# EAGLE design UtilityStrip1 (EAGLE 7.7.0)
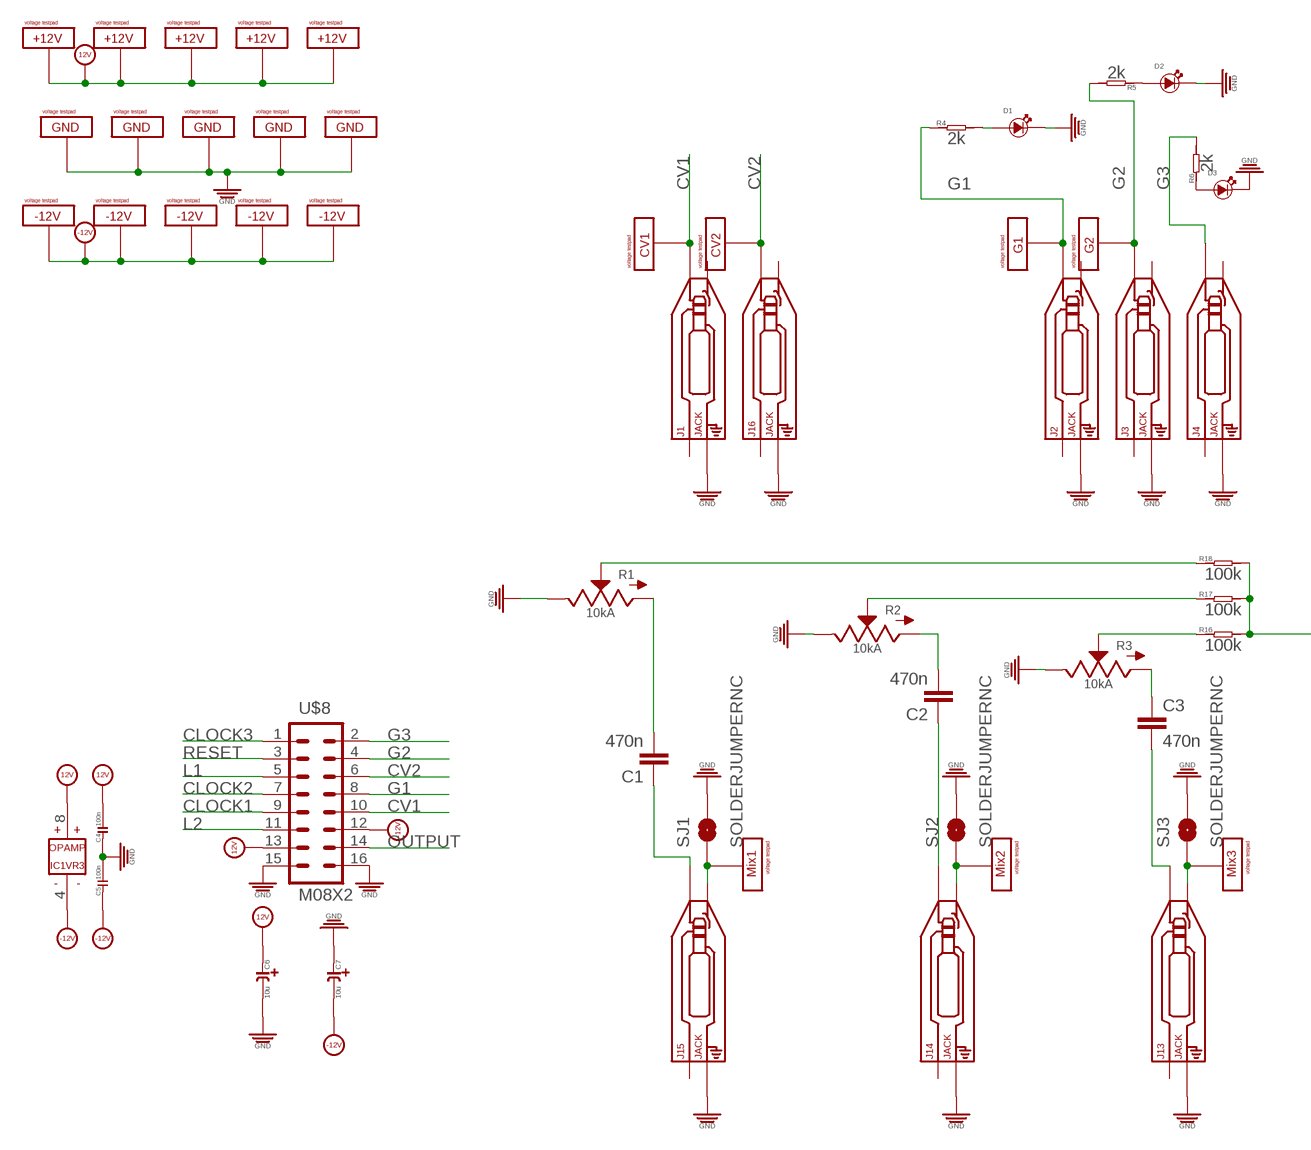
[diagram p0: schematic, sheet 1, part 1 of 2]
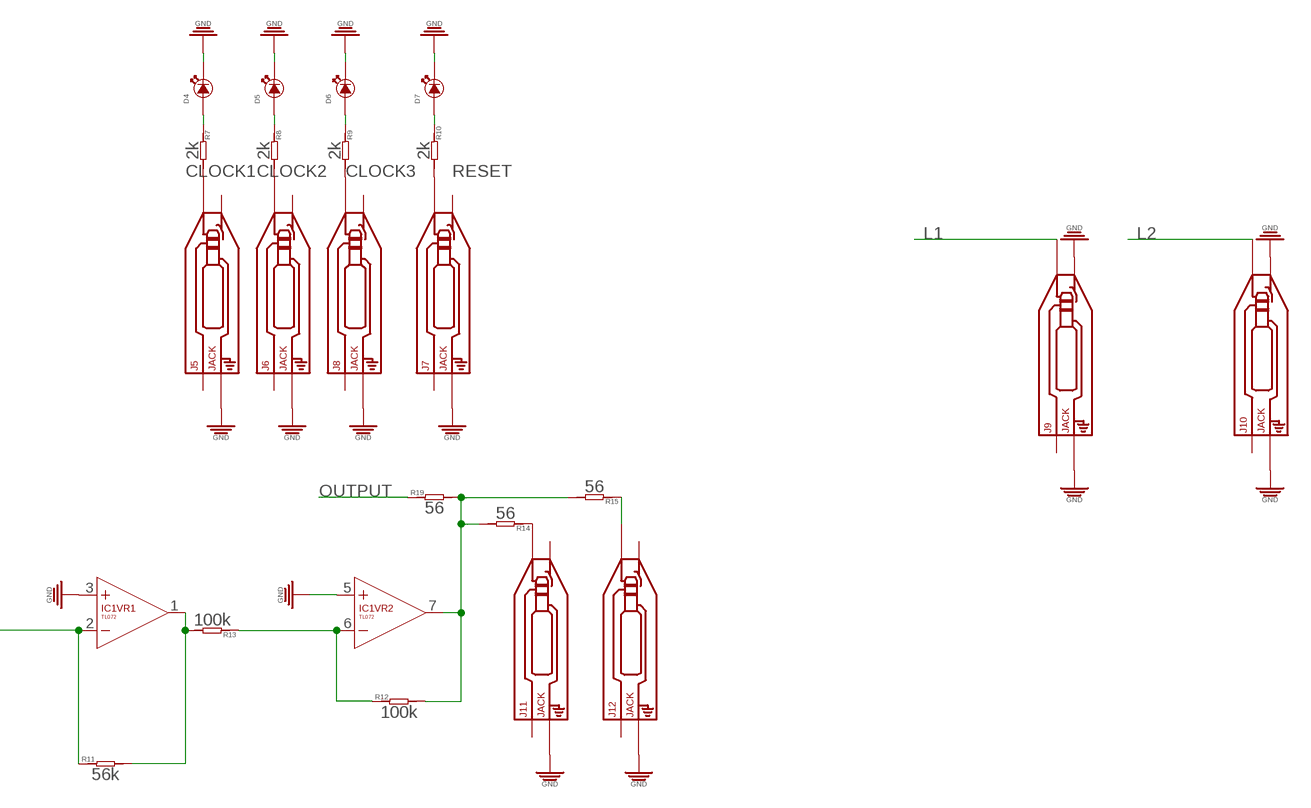
[diagram p1: schematic, sheet 1, part 2 of 2]

## Parts
C1  470n  C5/4.5  [C5B4.5]
C2  470n  C5/4.5  [C5B4.5]
C3  470n  C5/4.5  [C5B4.5]
C4  100n  C-0603  [C0603]
C5  100n  C-0603  [C0603]
C6  10u  C-POLAR-A  [CASE-A_3216]
C7  10u  C-POLAR-A  [CASE-A_3216]
D1  LED3MM  [3MMLED]
D2  LED3MM  [3MMLED]
D3  LED3MM  [3MMLED]
D4  LED3MM  [3MMLED]
D5  LED3MM  [3MMLED]
D6  LED3MM  [3MMLED]
D7  LED3MM  [3MMLED]
IC1  TL072  [SO08]
J1  JACK  AUDIO-JACK_SMALLSYMBOLNODRILL  [3.5MM-JACK-SWITCH-13MM-NOHOLES]
J2  JACK  AUDIO-JACK_SMALLSYMBOLNODRILL  [3.5MM-JACK-SWITCH-13MM-NOHOLES]
J3  JACK  AUDIO-JACK_SMALLSYMBOLNODRILL  [3.5MM-JACK-SWITCH-13MM-NOHOLES]
J4  JACK  AUDIO-JACK_SMALLSYMBOLNODRILL  [3.5MM-JACK-SWITCH-13MM-NOHOLES]
J5  JACK  AUDIO-JACK_SMALLSYMBOLNODRILL  [3.5MM-JACK-SWITCH-13MM-NOHOLES]
J6  JACK  AUDIO-JACK_SMALLSYMBOLNODRILL  [3.5MM-JACK-SWITCH-13MM-NOHOLES]
J7  JACK  AUDIO-JACK_SMALLSYMBOLNODRILL  [3.5MM-JACK-SWITCH-13MM-NOHOLES]
J8  JACK  AUDIO-JACK_SMALLSYMBOLNODRILL  [3.5MM-JACK-SWITCH-13MM-NOHOLES]
J9  JACK  AUDIO-JACK_SMALLSYMBOLNODRILL  [3.5MM-JACK-SWITCH-13MM-NOHOLES]
J10  JACK  AUDIO-JACK_SMALLSYMBOLNODRILL  [3.5MM-JACK-SWITCH-13MM-NOHOLES]
J11  JACK  AUDIO-JACK_SMALLSYMBOLNODRILL  [3.5MM-JACK-SWITCH-13MM-NOHOLES]
J12  JACK  AUDIO-JACK_SMALLSYMBOLNODRILL  [3.5MM-JACK-SWITCH-13MM-NOHOLES]
J13  JACK  AUDIO-JACK_SMALLSYMBOLNODRILL  [3.5MM-JACK-SWITCH-13MM-NOHOLES]
J14  JACK  AUDIO-JACK_SMALLSYMBOLNODRILL  [3.5MM-JACK-SWITCH-13MM-NOHOLES]
J15  JACK  AUDIO-JACK_SMALLSYMBOLNODRILL  [3.5MM-JACK-SWITCH-13MM-NOHOLES]
J16  JACK  AUDIO-JACK_SMALLSYMBOLNODRILL  [3.5MM-JACK-SWITCH-13MM-NOHOLES]
R1  10kA  POTSQUAREHOLE_SMALLKNOB  [ALPS_POT_SQUAREHOLES]
R2  10kA  POTSQUAREHOLE_SMALLKNOB  [ALPS_POT_SQUAREHOLES]
R3  10kA  POTSQUAREHOLE_SMALLKNOB  [ALPS_POT_SQUAREHOLES]
R4  2k  R-0603  [R0603]
R5  2k  R-0603  [R0603]
R6  2k  R-0603  [R0603]
R7  2k  R-0603  [R0603]
R8  2k  R-0603  [R0603]
R9  2k  R-0603  [R0603]
R10  2k  R-0603  [R0603]
R11  56k  R-0603  [R0603]
R12  100k  R-0603  [R0603]
R13  100k  R-0603  [R0603]
R14  56  R-0603  [R0603]
R15  56  R-0603  [R0603]
R16  100k  R-0603  [R0603]
R17  100k  R-0603  [R0603]
R18  100k  R-0603  [R0603]
R19  56  R-0603  [R0603]
SJ1  SOLDERJUMPERNC  [SJ_2S]
SJ2  SOLDERJUMPERNC  [SJ_2S]
SJ3  SOLDERJUMPERNC  [SJ_2S]
U$1  VOLTAGETESTPAD  [POWERTESTPAD]
U$2  VOLTAGETESTPAD  [POWERTESTPAD]
U$3  VOLTAGETESTPAD  [POWERTESTPAD]
U$4  VOLTAGETESTPAD  [POWERTESTPAD]
U$5  VOLTAGETESTPAD  [POWERTESTPAD]
U$6  VOLTAGETESTPAD  [POWERTESTPAD]
U$7  VOLTAGETESTPAD  [POWERTESTPAD]
U$8  M08X2  [2X8]
U$9  VOLTAGETESTPAD  [POWERTESTPAD]
U$10  VOLTAGETESTPAD  [POWERTESTPAD]
U$11  VOLTAGETESTPAD  [POWERTESTPAD]
U$12  VOLTAGETESTPAD  [POWERTESTPAD]
U$13  VOLTAGETESTPAD  [POWERTESTPAD]
U$14  VOLTAGETESTPAD  [POWERTESTPAD]
U$15  VOLTAGETESTPAD  [POWERTESTPAD]
U$16  VOLTAGETESTPAD  [POWERTESTPAD]
U$17  VOLTAGETESTPAD  [POWERTESTPAD]
U$18  VOLTAGETESTPAD  [POWERTESTPAD]
U$19  VOLTAGETESTPAD  [POWERTESTPAD]
U$20  VOLTAGETESTPAD  [POWERTESTPAD]
U$21  VOLTAGETESTPAD  [POWERTESTPAD]
U$22  VOLTAGETESTPAD  [POWERTESTPAD]
U$23  VOLTAGETESTPAD  [POWERTESTPAD]

## Nets
12V [power]: C4.2 C6.+ IC1.8(VR3:V+) U$8.13 U$9.P$1(VOLTAGE) U$9.P$2(VOLTAGE) U$9.P$3(VOLTAGE) U$10.P$1(VOLTAGE) U$10.P$2(VOLTAGE) U$10.P$3(VOLTAGE) U$11.P$1(VOLTAGE) U$11.P$2(VOLTAGE) U$11.P$3(VOLTAGE) U$12.P$1(VOLTAGE) U$12.P$2(VOLTAGE) U$12.P$3(VOLTAGE) U$13.P$1(VOLTAGE) U$13.P$2(VOLTAGE) U$13.P$3(VOLTAGE)
-12V [power]: C5.1 C7.- IC1.4(VR3:V-) U$8.12 U$14.P$1(VOLTAGE) U$14.P$2(VOLTAGE) U$14.P$3(VOLTAGE) U$20.P$1(VOLTAGE) U$20.P$2(VOLTAGE) U$20.P$3(VOLTAGE) U$21.P$1(VOLTAGE) U$21.P$2(VOLTAGE) U$21.P$3(VOLTAGE) U$22.P$1(VOLTAGE) U$22.P$2(VOLTAGE) U$22.P$3(VOLTAGE) U$23.P$1(VOLTAGE) U$23.P$2(VOLTAGE) U$23.P$3(VOLTAGE)
CLOCK1: J5.TIP_B@1(TIP) J5.TIP_T@3(TIP) R7.2 U$8.9
CLOCK2: J6.TIP_B@1(TIP) J6.TIP_T@3(TIP) R8.2 U$8.7
CLOCK3: J8.TIP_B@1(TIP) J8.TIP_T@3(TIP) R9.2 U$8.1
CV1: J1.TIP_B@1(TIP) J1.TIP_T@3(TIP) U$1.P$1(VOLTAGE) U$1.P$2(VOLTAGE) U$1.P$3(VOLTAGE) U$8.10
CV2: J16.TIP_B@1(TIP) J16.TIP_T@3(TIP) U$2.P$1(VOLTAGE) U$2.P$2(VOLTAGE) U$2.P$3(VOLTAGE) U$8.6
G1: J2.TIP_B@1(TIP) J2.TIP_T@3(TIP) R4.1 U$3.P$1(VOLTAGE) U$3.P$2(VOLTAGE) U$3.P$3(VOLTAGE) U$8.8
G2: J3.TIP_B@1(TIP) J3.TIP_T@3(TIP) R5.2 U$4.P$1(VOLTAGE) U$4.P$2(VOLTAGE) U$4.P$3(VOLTAGE) U$8.4
G3: J4.TIP_B@1(TIP) J4.TIP_T@3(TIP) R6.2 U$8.2
GND: C4.1 C5.2 C6.- C7.+ D1.- D2.- D3.- D4.- D5.- D6.- D7.- IC1.3(VR1:+IN) IC1.5(VR2:+IN) J1.RING_B@1(RING) J1.RING_T@3(RING) J2.RING_B@1(RING) J2.RING_T@3(RING) J3.RING_B@1(RING) J3.RING_T@3(RING) J4.RING_B@1(RING) J4.RING_T@3(RING) J5.RING_B@1(RING) J5.RING_T@3(RING) J6.RING_B@1(RING) J6.RING_T@3(RING) J7.RING_B@1(RING) J7.RING_T@3(RING) J8.RING_B@1(RING) J8.RING_T@3(RING) J9.RING_B@1(RING) J9.RING_T@3(RING) J9.SWITCH_B@1(SWITCH) J9.SWITCH_T@3(SWITCH) J10.RING_B@1(RING) J10.RING_T@3(RING) J10.SWITCH_B@1(SWITCH) J10.SWITCH_T@3(SWITCH) J11.RING_B@1(RING) J11.RING_T@3(RING) J12.RING_B@1(RING) J12.RING_T@3(RING) J13.RING_B@1(RING) J13.RING_T@3(RING) J14.RING_B@1(RING) J14.RING_T@3(RING) J15.RING_B@1(RING) J15.RING_T@3(RING) J16.RING_B@1(RING) J16.RING_T@3(RING) R1.P$1(E) R2.P$1(E) R3.P$1(E) SJ1.2 SJ2.2 SJ3.2 U$8.15 U$8.16 U$15.P$1(VOLTAGE) U$15.P$2(VOLTAGE) U$15.P$3(VOLTAGE) U$16.P$1(VOLTAGE) U$16.P$2(VOLTAGE) U$16.P$3(VOLTAGE) U$17.P$1(VOLTAGE) U$17.P$2(VOLTAGE) U$17.P$3(VOLTAGE) U$18.P$1(VOLTAGE) U$18.P$2(VOLTAGE) U$18.P$3(VOLTAGE) U$19.P$1(VOLTAGE) U$19.P$2(VOLTAGE) U$19.P$3(VOLTAGE)
L1: J9.TIP_B@1(TIP) J9.TIP_T@3(TIP) U$8.5
L2: J10.TIP_B@1(TIP) J10.TIP_T@3(TIP) U$8.11
N$1: C1.2 R1.P$3(A)
N$2: C1.1 J15.TIP_B@1(TIP) J15.TIP_T@3(TIP)
N$3: C2.2 R2.P$3(A)
N$4: C2.1 J14.TIP_B@1(TIP) J14.TIP_T@3(TIP)
N$5: D4.+ R7.1
N$6: D5.+ R8.1
N$7: D6.+ R9.1
N$8: J15.SWITCH_B@1(SWITCH) J15.SWITCH_T@3(SWITCH) SJ1.1 U$5.P$1(VOLTAGE) U$5.P$2(VOLTAGE) U$5.P$3(VOLTAGE)
N$9: J14.SWITCH_B@1(SWITCH) J14.SWITCH_T@3(SWITCH) SJ2.1 U$6.P$1(VOLTAGE) U$6.P$2(VOLTAGE) U$6.P$3(VOLTAGE)
N$10: J13.SWITCH_B@1(SWITCH) J13.SWITCH_T@3(SWITCH) SJ3.1 U$7.P$1(VOLTAGE) U$7.P$2(VOLTAGE) U$7.P$3(VOLTAGE)
N$11: C3.1 R3.P$3(A)
N$12: D1.+ R4.2
N$13: C3.2 J13.TIP_B@1(TIP) J13.TIP_T@3(TIP)
N$14: D7.+ R10.1
N$15: D2.+ R5.1
N$16: D3.+ R6.1
N$17: J11.TIP_B@1(TIP) J11.TIP_T@3(TIP) R14.1
N$18: J12.TIP_B@1(TIP) J12.TIP_T@3(TIP) R15.1
N$19: IC1.1(VR1:OUT) R11.2 R13.2
N$20: IC1.6(VR2:-IN) R12.1 R13.1
N$21: IC1.7(VR2:OUT) R12.2 R14.2 R15.2 R19.2
N$22: IC1.2(VR1:-IN) R11.1 R16.2 R17.2 R18.2
N$23: R1.P$2(S) R18.1
N$24: R2.P$2(S) R17.1
N$25: R3.P$2(S) R16.1
OUTPUT: R19.1 U$8.14
RESET: J7.TIP_B@1(TIP) J7.TIP_T@3(TIP) R10.2 U$8.3
Unconnected: J1.SECOND_B@1(SECOND) J1.SECOND_T@3(SECOND) J1.SWITCH_B@1(SWITCH) J1.SWITCH_T@3(SWITCH) J2.SECOND_B@1(SECOND) J2.SECOND_T@3(SECOND) J2.SWITCH_B@1(SWITCH) J2.SWITCH_T@3(SWITCH) J3.SECOND_B@1(SECOND) J3.SECOND_T@3(SECOND) J3.SWITCH_B@1(SWITCH) J3.SWITCH_T@3(SWITCH) J4.SECOND_B@1(SECOND) J4.SECOND_T@3(SECOND) J4.SWITCH_B@1(SWITCH) J4.SWITCH_T@3(SWITCH) J5.SECOND_B@1(SECOND) J5.SECOND_T@3(SECOND) J5.SWITCH_B@1(SWITCH) J5.SWITCH_T@3(SWITCH) J6.SECOND_B@1(SECOND) J6.SECOND_T@3(SECOND) J6.SWITCH_B@1(SWITCH) J6.SWITCH_T@3(SWITCH) J7.SECOND_B@1(SECOND) J7.SECOND_T@3(SECOND) J7.SWITCH_B@1(SWITCH) J7.SWITCH_T@3(SWITCH) J8.SECOND_B@1(SECOND) J8.SECOND_T@3(SECOND) J8.SWITCH_B@1(SWITCH) J8.SWITCH_T@3(SWITCH) J9.SECOND_B@1(SECOND) J9.SECOND_T@3(SECOND) J10.SECOND_B@1(SECOND) J10.SECOND_T@3(SECOND) J11.SECOND_B@1(SECOND) J11.SECOND_T@3(SECOND) J11.SWITCH_B@1(SWITCH) J11.SWITCH_T@3(SWITCH) J12.SECOND_B@1(SECOND) J12.SECOND_T@3(SECOND) J12.SWITCH_B@1(SWITCH) J12.SWITCH_T@3(SWITCH) J13.SECOND_B@1(SECOND) J13.SECOND_T@3(SECOND) J14.SECOND_B@1(SECOND) J14.SECOND_T@3(SECOND) J15.SECOND_B@1(SECOND) J15.SECOND_T@3(SECOND) J16.SECOND_B@1(SECOND) J16.SECOND_T@3(SECOND) J16.SWITCH_B@1(SWITCH) J16.SWITCH_T@3(SWITCH)

## Library data of the parts
C1-C3 = capacitor-wima:C: CAPACITOR naming: grid - package width
C4 C5 = OPL:C*
C6 C7 = EurorackModularParts:C-POLAR*
D1-D7 = EurorackModularParts:LED*: LED
IC1 = EurorackModularParts:TL072
J1 = EurorackModularParts:AUDIO-JACK_SMALLSYMBOL: Switching Mono 3.5mm Audio Jack from Erthenvar.; DESC: CV 1
J2 = EurorackModularParts:AUDIO-JACK_SMALLSYMBOL: Switching Mono 3.5mm Audio Jack from Erthenvar.; DESC: Gate 1
J3 = EurorackModularParts:AUDIO-JACK_SMALLSYMBOL: Switching Mono 3.5mm Audio Jack from Erthenvar.; DESC: Gate 2
J4 = EurorackModularParts:AUDIO-JACK_SMALLSYMBOL: Switching Mono 3.5mm Audio Jack from Erthenvar.; DESC: Gate 3
J5 = EurorackModularParts:AUDIO-JACK_SMALLSYMBOL: Switching Mono 3.5mm Audio Jack from Erthenvar.; DESC: Clock 1
J6 = EurorackModularParts:AUDIO-JACK_SMALLSYMBOL: Switching Mono 3.5mm Audio Jack from Erthenvar.; DESC: Clock 2
J7 = EurorackModularParts:AUDIO-JACK_SMALLSYMBOL: Switching Mono 3.5mm Audio Jack from Erthenvar.; DESC: Reset
J8 = EurorackModularParts:AUDIO-JACK_SMALLSYMBOL: Switching Mono 3.5mm Audio Jack from Erthenvar.; DESC: Clock 3
J9 = EurorackModularParts:AUDIO-JACK_SMALLSYMBOL: Switching Mono 3.5mm Audio Jack from Erthenvar.; DESC: LED 1
J10 = EurorackModularParts:AUDIO-JACK_SMALLSYMBOL: Switching Mono 3.5mm Audio Jack from Erthenvar.; DESC: LED 2
J11 J12 = EurorackModularParts:AUDIO-JACK_SMALLSYMBOL: Switching Mono 3.5mm Audio Jack from Erthenvar.; DESC: Out
J13 = EurorackModularParts:AUDIO-JACK_SMALLSYMBOL: Switching Mono 3.5mm Audio Jack from Erthenvar.; DESC: Mix 3
J14 = EurorackModularParts:AUDIO-JACK_SMALLSYMBOL: Switching Mono 3.5mm Audio Jack from Erthenvar.; DESC: Mix 2
J15 = EurorackModularParts:AUDIO-JACK_SMALLSYMBOL: Switching Mono 3.5mm Audio Jack from Erthenvar.; DESC: Mix 1
J16 = EurorackModularParts:AUDIO-JACK_SMALLSYMBOL: Switching Mono 3.5mm Audio Jack from Erthenvar.; DESC: CV 2
R1 = EurorackModularParts:POT; DESC: 1
R2 = EurorackModularParts:POT; DESC: 2
R3 = EurorackModularParts:POT; DESC: 3
R4-R19 = OPL:R*
SJ1-SJ3 = SparkFun-Passives:SOLDERJUMPER: Solder Jumper Standard SMD solder jumper. Used to automate production. Two varients : Normally Open and Normally Closed are the same, but have different paste layers. NC will have a large amount of paste and should jumper during reflow.
U$1 = FenixBase:VOLTAGETESTPAD; DESC: CV1
U$2 = FenixBase:VOLTAGETESTPAD; DESC: CV2
U$3 = FenixBase:VOLTAGETESTPAD; DESC: G1
U$4 = FenixBase:VOLTAGETESTPAD; DESC: G2
U$5 = FenixBase:VOLTAGETESTPAD; DESC: Mix1
U$6 = FenixBase:VOLTAGETESTPAD; DESC: Mix2
U$7 = FenixBase:VOLTAGETESTPAD; DESC: Mix3
U$8 = SparkFun-Connectors:M08X2: .1" headers, two rows of 8 each
U$9-U$13 = FenixBase:VOLTAGETESTPAD; DESC: +12V
U$14 U$20-U$23 = FenixBase:VOLTAGETESTPAD; DESC: -12V
U$15-U$19 = FenixBase:VOLTAGETESTPAD; DESC: GND

## Net classes
0 default: width 0.254 mm
1 power: width 0.762 mm

## Board
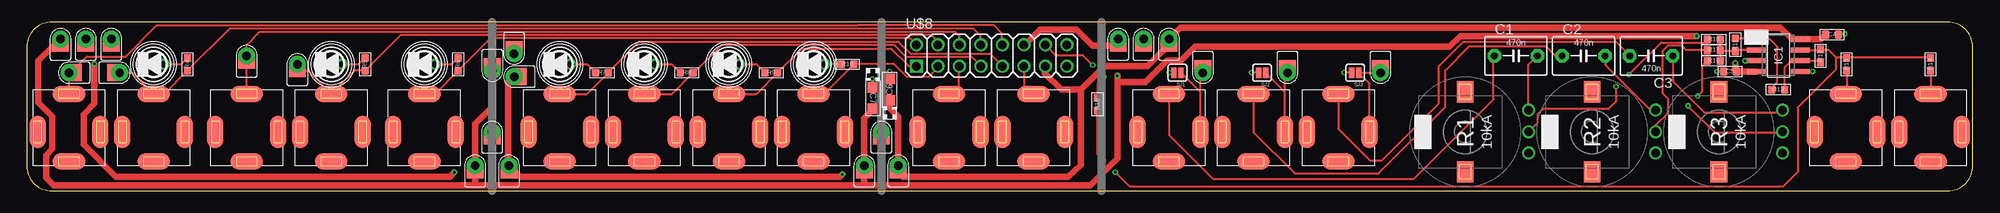
[diagram p2: board, top side]
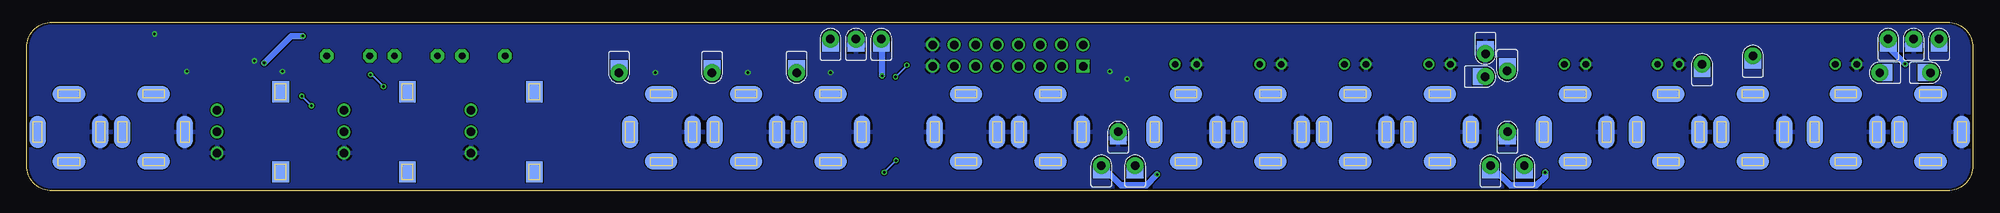
[diagram p3: board, bottom side, seen from below]

Size 230 x 20 mm. Coordinates in mm from the lower left corner, seen from the top.
Outline: 0,17 0,3 arc90 3,0 227,0 arc90 230,3 230,17 arc90 227,20 3,20 arc90 0,17
Copper layers (1*16): Top 0.035mm / dielectric 1.5mm / Bottom 0.035mm
Design rules "dirt_cheap_dirty_boards.v1": minimum track width 5mil, minimum drill 12mil, track to track 5mil, track to pad 5mil, pad to pad 5mil, via to via 5mil, smd to smd 0mil, copper to edge 10mil, drill to drill 10mil, minimum pad ring 10mil, minimum via ring 6mil, stop-mask expansion 2mil, vias tented up to drill 25mil, thermal gap 10mil

### Footprints (pad centres in the part's own frame; a part is rotated, then mirrored left to right if it is on the bottom)
C5B4.5 = drill 0.813 pad 1.6 octagon: 1 -2.54,0; 2 2.54,0
C0603 = smd 0.889 x 0.889: 1 -0.762,0; 2 0.762,0
CASE-A_3216 = smd 1.27 x 1.27: + -1.27,0; - 1.27,0
3MMLED = drill 0.8: + -1.27,0; - 1.27,0
SO08 = smd 0.6 x 2.2: 1 -1.905,-2.6; 2 -0.635,-2.6; 3 0.635,-2.6; 4 1.905,-2.6; 5 1.905,2.6; 6 0.635,2.6; 7 -0.635,2.6; 8 -1.905,2.6
3.5MM-JACK-SWITCH-13MM-NOHOLES = smd 1.95 x 3.85 bottom: RING_B@1 -3.7,0; SWITCH_B@1 3.7,0 | smd 1.95 x 3.85: RING_T@3 -3.7,0; SWITCH_T@3 3.7,0 | smd 3.85 x 1.95 bottom: SECOND_B@1 0,-3.5; TIP_B@1 0,4.5 | smd 3.85 x 1.95: SECOND_T@3 0,-3.5; TIP_T@3 0,4.5
ALPS_POT_SQUAREHOLES = drill 1: P$1 -2.5,-7.5; P$2 0,-7.5; P$3 2.58,-7.5 | smd 2.5 x 2: P$4 -4.75,0; P$5 4.75,0 | smd 2.5 x 2 bottom: P$6 -4.75,0; P$7 4.75,0
R0603 = smd 0.889 x 0.889: 1 -0.762,0; 2 0.762,0
SJ_2S = smd 0.635 x 1.27: 1 -0.412,0; 2 0.412,0
POWERTESTPAD = drill 1 pad 2: P$1 0,0 | smd 2 x 1.5: P$2 0,-0.75 | smd 2 x 1.5 bottom: P$3 0,-0.75
2X8 = drill 1.016 square: 1 0,0 | drill 1.016: 2 0,2.54; 3 2.54,0; 4 2.54,2.54; 5 5.08,0; 6 5.08,2.54; 7 7.62,0; 8 7.62,2.54; 9 10.16,0; 10 10.16,2.54; 11 12.7,0; 12 12.7,2.54; 13 15.24,0; 14 15.24,2.54; 15 17.78,0; 16 17.78,2.54

### Placement (x,y rotation side)
C1  176,16 0 top
C2  184,16 0 top
C3  192,16 180 top
C4  213.35,18.51 180 top
C5  201.29,14.14 180 top
C6  102,12 90 top
C7  100,11 270 top
D1  15,15 180 top
D2  36,15 180 top
D3  47,15 180 top
D4  63,15 180 top
D5  73,15 180 top
D6  83,15 180 top
D7  93,15 180 top
IC1  207.01,16.05 270 top
J1  5,7 0 top
J2  15,7 0 top
J3  36,7 0 top
J4  47,7 0 top
J5  63,7 0 top
J6  73,7 0 top
J7  93,7 0 top
J8  83,7 0 top
J9  109,7 0 top
J10  119,7 0 top
J11  225,7 0 top
J12  215,7 0 top
J13  155,7 0 top
J14  145,7 0 top
J15  135,7 0 top
J16  26,7 0 top
R1  170,7 90 top
R2  185,7 90 top
R3  200,7 90 top
R4  19,15 90 top
R5  40,15 270 top
R6  51,15 270 top
R7  68,14 0 top
R8  78,14 0 top
R9  88,14 0 top
R10  97,15 0 top
R11  201.93,17.32 90 top
R12  212,16 90 top
R13  207,12 180 top
R14  225,15 90 top
R15  215.08,15 90 top
R16  199.39,15.41 0 top
R17  199.39,16.68 0 top
R18  199.39,17.95 0 top
R19  126.56,10.27 270 top
SJ1  136,14 180 top
SJ2  146,14 180 top
SJ3  157,14 180 top
U$1  5,14 90 top
U$2  26,16 0 top
U$3  11,14 270 top
U$4  32,15 0 top
U$5  139,14 180 top
U$6  149,14 180 top
U$7  160,14 180 top
U$8  105.16,14.78 0 top
U$9  10,18 0 top
U$10  57,3 0 top
U$11  135,18 0 top
U$12  103,3 0 top
U$13  57.61,13.53 90 top
U$14  99,3 0 top
U$15  7,18 0 top
U$16  55,7 0 top
U$17  132,18 0 top
U$18  57.6,16.26 180 top
U$19  101,7 0 top
U$20  129,18 0 top
U$21  55.03,14.23 180 top
U$22  53,3 0 top
U$23  4,18 0 top

### Tracks (layer width: path | path; a pad name or v marks a point on that pad's centre or on a via)
12V  (via drill 0.3)
  Top 0.762: C6.+ 101.98,10.71 101.98,9.83 103,8.81 U$12.P$1 | U$8.13 120.37,13.92 122.3,11.99 124.59,11.99 | 124.59,11.99 127.38,14.78 132.46,14.78 134.37,16.68 134.44,16.68 U$11.P$2 | C4.2 212.03,17.95 IC1.8 208.66,17.95 207.26,19.35 136.35,19.35 U$11.P$1 | 124.59,11.99 124.59,3.1 123.06,1.7 103.55,1.7 U$12.P$2 | v8,15.03 8,10.34 6.73,9.06 6.73,5.51 10.54,1.7 50.04,1.7 v50.55,2.21 | v96.39,1.95 96.14,1.7 58.29,1.7 U$10.P$1 56.9,3.1 56.9,12.88 57.55,13.53 U$13.P$1
  Bottom 0.762: U$9.P$2 10,17.03 v8,15.03 | v50.55,2.21 50.55,1.7 51.56,0.68 54.68,0.68 U$10.P$1 | v96.39,1.95 97.66,0.68 100.68,0.68 U$12.P$1
-12V  (via drill 0.3)
  Top 0.762: C7.- 100,9.62 98.93,8.56 98.93,3.07 | U$8.12 117.97,17.3 119.76,19.1 124.08,19.1 125.98,17.19 128.94,17.19 U$20.P$2 | 98.93,3.07 U$14.P$1 | IC1.4 C5.1 201.93,14.27 v201.93,15.16 | U$23.P$2 3.23,17.25 1.4,15.41 1.4,10.46 3.05,8.81 3.05,5 2.29,4.24 2.29,1.57 3.17,0.68 52.96,0.68 | 52.96,0.68 99.06,0.68 | 99.06,0.68 125.73,0.68 128.91,3.86 128.91,12.88 | 128.91,12.88 v128.91,13.64 | 98.93,3.07 98.93,0.81 99.06,0.68 | 52.96,0.68 53,0.72 U$22.P$1 53,7.96 55.12,10.08 55.12,13.77 U$21.P$1 | 128.91,12.88 132.21,12.88 134.75,15.41 136.4,15.41 138.05,17.07 168.15,17.07 169.42,18.34 v197.36,18.34
  Bottom 0.762: v128.91,13.64 128.91,17.91 U$20.P$1 | v197.36,18.34 198.75,18.34 v201.93,15.16
CLOCK1
  Top 0.254: J5.TIP_T@3 66.26,11.5 R7.2 68.76,14.07 72.39,17.7 103,17.7 104.46,16.24 113.86,16.24 U$8.9
CLOCK2
  Top 0.254: J6.TIP_T@3 76.26,11.5 R8.2 78.85,14 82.17,17.32 102.49,17.32 103.95,15.86 111.7,15.86 U$8.7
CLOCK3
  Top 0.254: J8.TIP_T@3 86.26,11.5 R9.2 91.57,16.81 102.23,16.81 104.27,14.78 U$8.1
CV1
  Top 0.254: U$1.P$1 J1.TIP_B@1 | U$8.10 115.29,18.62 114.3,19.61 104.78,19.61 98.17,19.61 15.37,19.61 11.68,15.92 7.11,15.92 5.75,14.56 U$1.P$2
CV2
  Top 0.254: J16.TIP_B@1 U$2.P$1 26,17.29 27.56,18.84 109.73,18.84 110.24,18.34 U$8.6
G1
  Top 0.254: U$3.P$1 12.5,14 J2.TIP_B@1 16.26,11.5 R4.1 23.99,19.23 111.89,19.23 112.75,18.36 U$8.8
G2
  Top 0.254: U$4.P$2 33.25,14.25 J3.TIP_B@1 38.74,14.24 R5.2 44.23,18.46 106.93,18.46 107.7,17.7 U$8.4
G3
  Top 0.254: J4.TIP_B@1 48.26,11.5 R6.2 54.84,18.08 104.39,18.08 U$8.2
GND  (via drill 0.3)
  Top 0.254: C6.- 102,14.13 v101.98,14.14 | C7.+ 100,13.2 v99.95,13.26 | SJ3.2 155.72,14 v155.7,14.02 | SJ2.2 144.93,14 144.91,14.02 v144.78,14.02 | SJ1.2 135.02,14 v135,14.02 | IC1.3 v203.07,15.41 | C5.2 v199.77,14.14 | IC1.5 v211.07,14.14 | C4.1 214.8,18.51 v214.88,18.59
  Bottom 0.254: v101.98,14.14 101.98,14.4 | v99.95,13.26 99.95,13.38 | v155.7,14.02 155.45,14.02 | v144.78,14.02 144.65,14.02 | v135,14.02 134.75,14.02 | v203.07,15.41 202.95,15.41 | v199.77,14.14 199.64,14.14 | v211.07,14.14 211.2,14.14 | v214.88,18.59 215.01,18.59
  pour Bottom: -1,33 232,33 232,-13 -1,-13
L1
  Top 0.254: U$8.5 110.11,14.66 110.11,11.86 109.75,11.5 J9.TIP_T@3
L2
  Top 0.254: U$8.11 117.86,11.86 118.22,11.5 J10.TIP_T@3
N$1
  Top 0.254: R1.P$3 177.5,14.96 C1.2
N$2
  Top 0.254: J15.TIP_T@3 135,6.65 140.21,1.45 163.96,1.45 173.35,10.84 173.35,15.89 C1.1
N$3
  Top 0.254: C2.2 186.54,14.93 191.9,9.57 R2.P$3
N$4
  Top 0.254: J14.TIP_T@3 145,6.94 149.86,2.08 159.77,2.08 167.64,9.95 167.64,14.27 170.43,17.07 179.58,17.07 180.64,16 C2.1
N$5
  Top 0.254: D4.+ 66.24,15 R7.1
N$6
  Top 0.254: D5.+ 76.24,15 R8.1
N$7
  Top 0.254: D6.+ 86.24,15 R9.1
N$8
  Top 0.254: J15.SWITCH_T@3 138.7,9.89 138.7,11.71 | 138.7,11.71 138.7,13.7 U$5.P$1 | 138.7,11.71 SJ1.1
N$9
  Top 0.254: J14.SWITCH_T@3 148.7,11.71 | 148.7,11.71 SJ2.1 | 148.7,11.71 148.7,13.7 U$6.P$1
N$10
  Top 0.254: U$7.P$1 SJ3.1 158.7,12.71 J13.SWITCH_T@3
N$11
  Top 0.254: C3.1 194.54,13.03 198.25,9.32 207.24,9.32 R3.P$3
N$12
  Top 0.254: D1.+ 18.24,15 R4.2
N$13
  Top 0.254: J13.TIP_T@3 155,7.35 158.75,3.6 160.15,3.6 166.88,10.34 166.88,14.78 169.7,17.61 187.85,17.61 C3.2
N$14
  Top 0.254: R10.1 D7.+
N$15
  Top 0.254: D2.+ 39.24,15 R5.1
N$16
  Top 0.254: D3.+ 50.24,15 R6.1
N$17
  Top 0.254: R14.1 J11.TIP_T@3
N$18
  Top 0.254: R15.1 215.08,11.58 J12.TIP_T@3
N$19
  Top 0.254: R11.2 204.28,18.08 IC1.1 205.99,17.95 206.88,17.07 206.88,12.88 206.24,12.23 R13.2
N$20
  Top 0.254: R13.1 207.76,14.64 208.41,15.29 209.48,15.29 IC1.6 211.82,15.41 R12.1
N$21  (via drill 0.3)
  Top 0.254: IC1.7 211.92,16.68 R12.2 212.08,16.68 212.98,16.68 213.8,15.86 | 213.8,15.86 213.9,15.76 R15.2 R14.2 | 213.8,15.86 213.8,14.4 209.3,9.89 209.3,2.27 207.52,0.49 130.37,0.49 v128.65,2.21 | v127.25,3.6 126.56,4.3 R19.2
  Bottom 0.254: v128.65,2.21 v127.25,3.6
N$22
  Top 0.254: IC1.2 202.06,16.68 R11.1 200.28,16.56 R17.2 | R17.2 R18.2 | R17.2 R16.2
N$23  (via drill 0.3)
  Top 0.254: v189.36,13.76 193.17,17.57 198.25,17.57 R18.1 | v187.83,12.37 187.83,10.59 186.94,9.7 179.2,9.7 178.56,9.06 178.56,8.06 R1.P$2
  Bottom 0.254: v189.36,13.76 189.23,13.76 v187.83,12.37
N$24
  Top 0.254: R17.1 196.09,16.68 195.58,17.19 193.93,17.19 193.29,16.56 193.29,11.61 193.93,10.97 193.93,9.19 192.53,7.79 192.53,7.16 192.41,7.03 192.47,7.03 R2.P$2
N$25  (via drill 0.3)
  Top 0.254: R16.1 197.99,14.78 197.99,11.73 v197.49,11.22 | v196.34,10.08 199.52,6.91 207.41,6.91 R3.P$2
  Bottom 0.254: v197.49,11.22 v196.34,10.08
OUTPUT  (via drill 0.3)
  Top 0.254: U$8.14 121.6,16.11 124.78,16.11 v125.98,14.91 | v127.32,13.51 127.32,13.45 126.56,12.68 R19.1
  Bottom 0.254: v125.98,14.91 125.98,14.84 v127.32,13.51
RESET
  Top 0.254: J7.TIP_T@3 94.26,11.5 R10.2 97.8,15.03 102.49,15.03 104.01,13.51 106.55,13.51 107.7,14.65 U$8.3